# EasyEDA Pro project Chaoticvolt-SensorHUB-v1.0.eprj

# Schematic Choaticvolt_DP2_V1
Board Name: Choaticvolt_DP2_V1; Create Date: 2024-12-06; Page Name: Choaticvolt_DP2_V1; Project Name: Chaoticvolt-SensorHUB-v1.0; Schematic Name: Choaticvolt_DP2_V1; Update Date: 2024-12-07; Company: Chaoticvolt; Drawn: Robin; Page Size: A4; Part Number: CV-SHV1; Reviewed: Robin; Version: V1.0
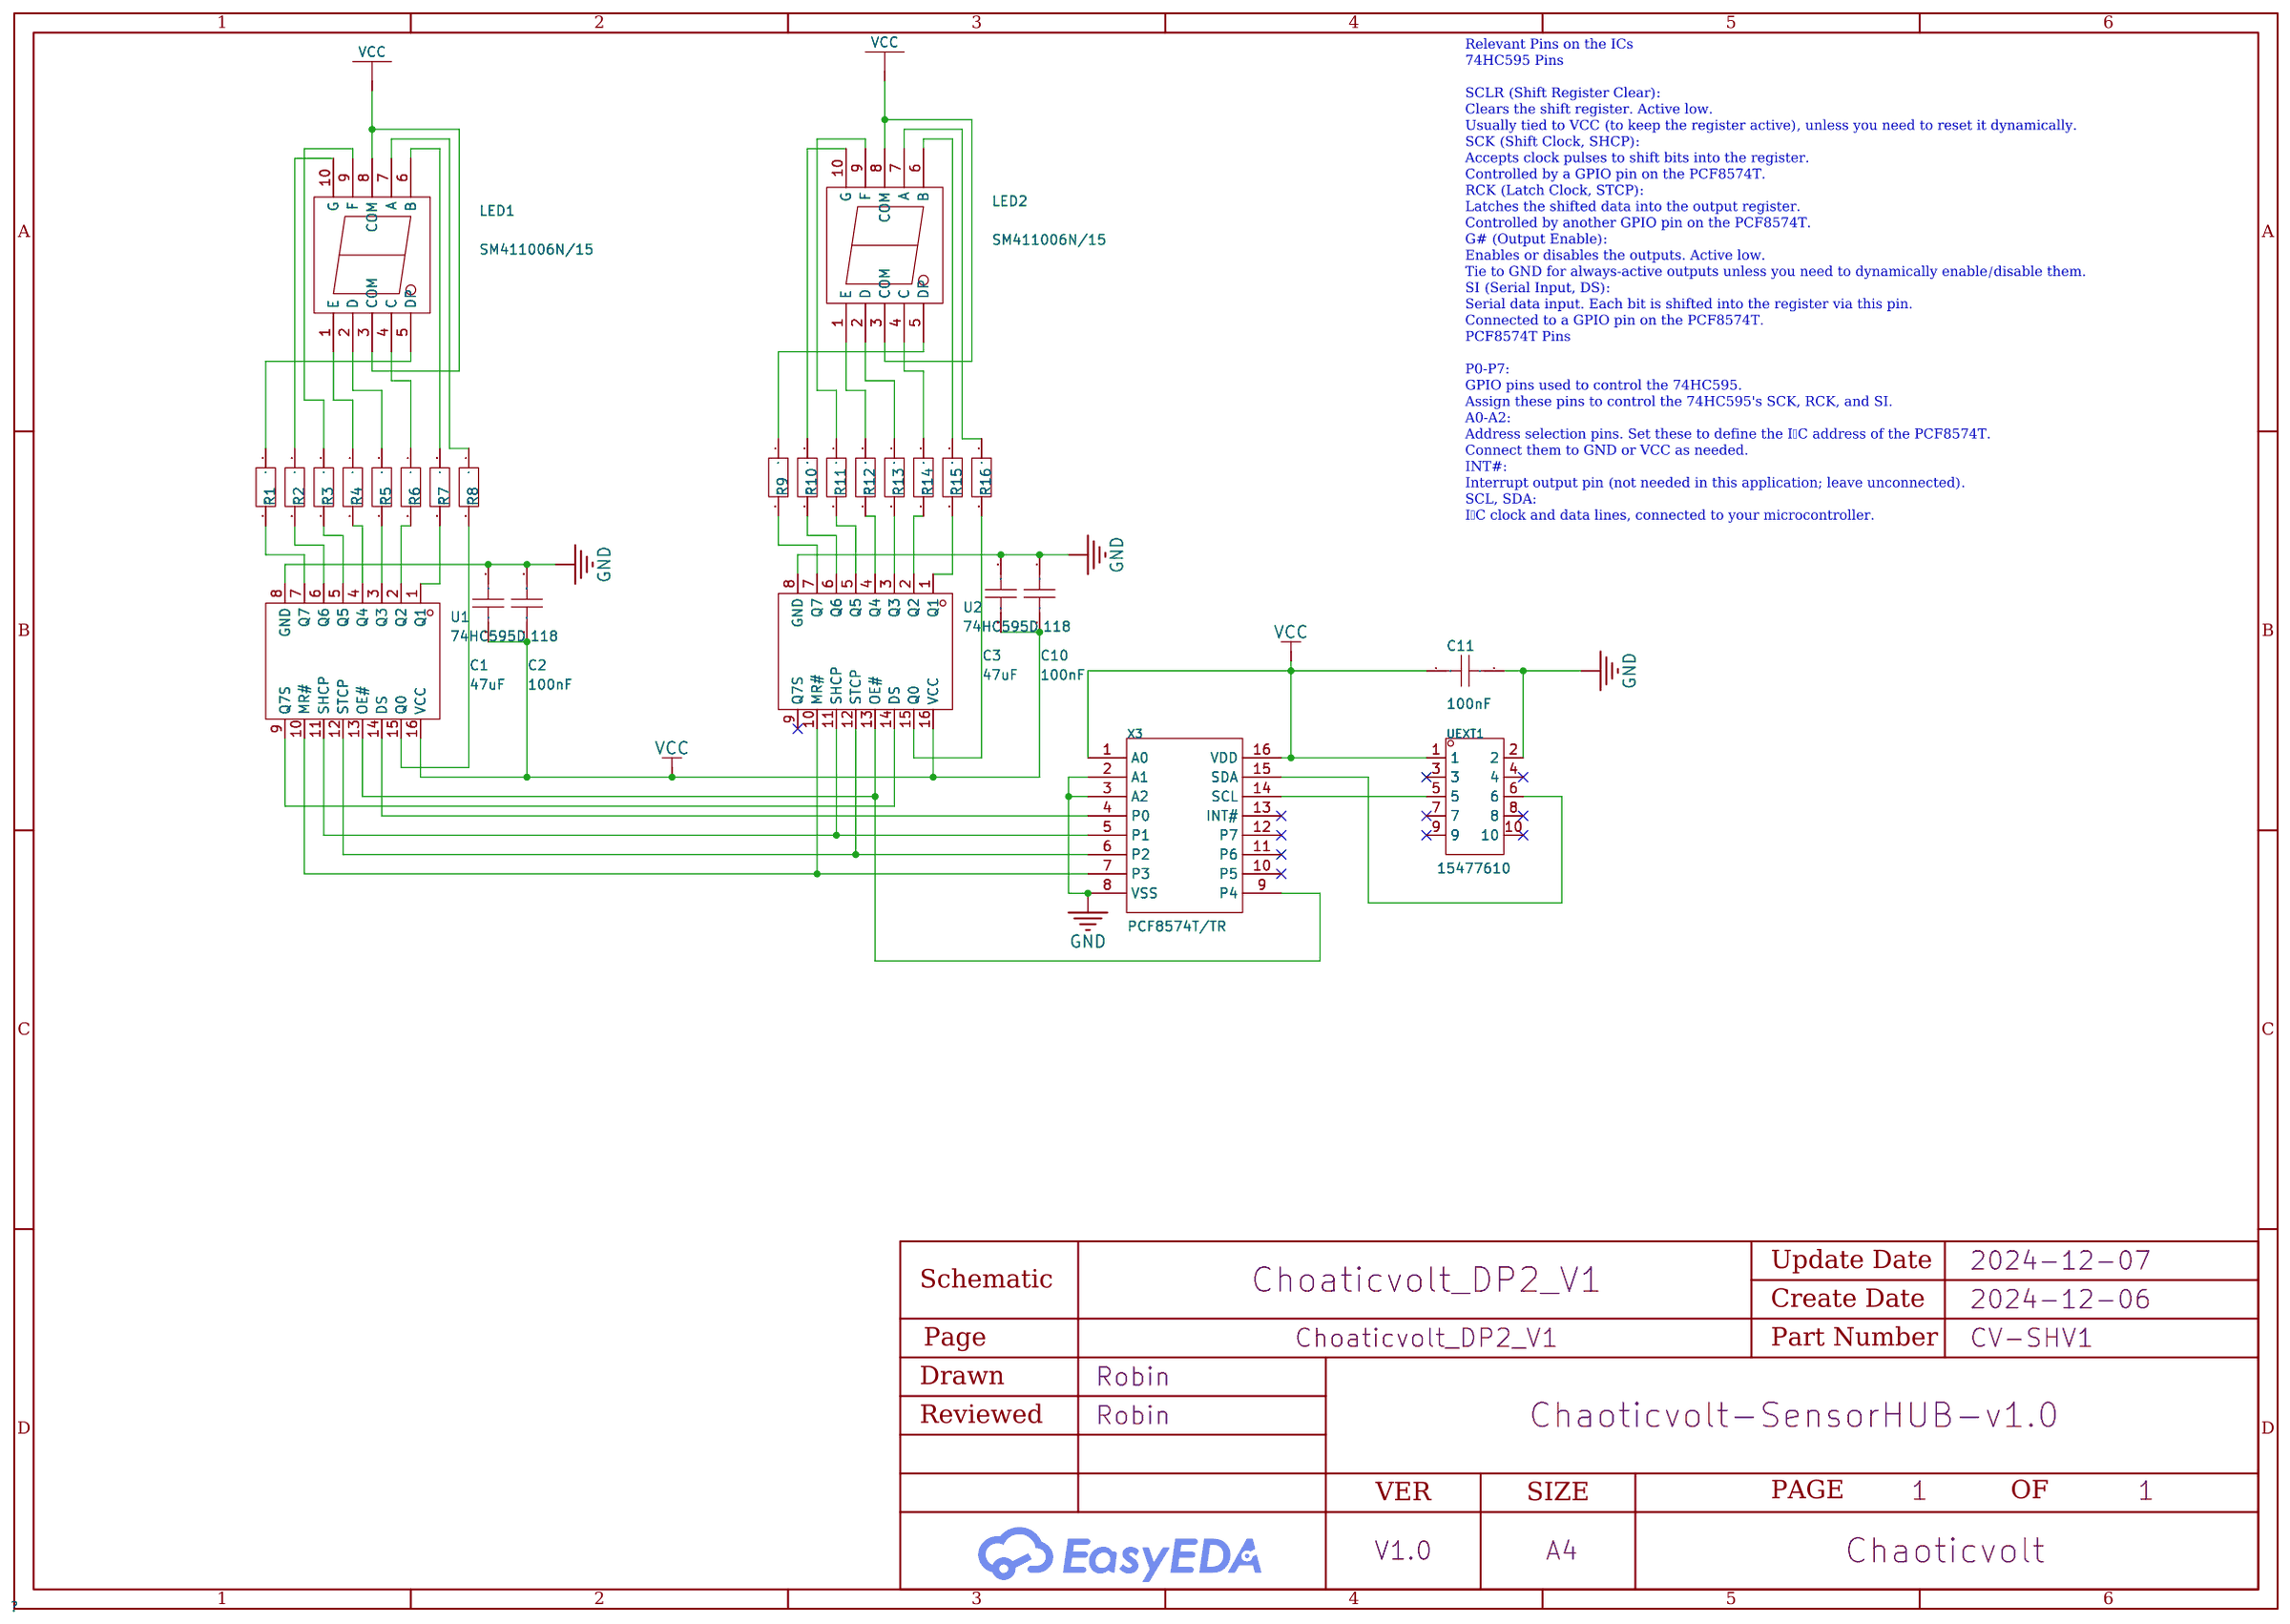
[diagram p0: schematic sheet]

## Parts
C1  47uF  [C1206]
C2  100nF  [C0402]
C3  47uF  [C1206]
C10  100nF  [C0402]
C11  100nF  [C0402]
LED1  SM411006N/15  [LED-SEG-TH_10P-L24.0-W34.0-P2.54-S30.48-BL]
LED2  SM411006N/15  [LED-SEG-TH_10P-L24.0-W34.0-P2.54-S30.48-BL]
R1  120Ω  [R0805]
R2  120Ω  [R0805]
R3  120Ω  [R0805]
R4  120Ω  [R0805]
R5  120Ω  [R0805]
R6  120Ω  [R0805]
R7  120Ω  [R0805]
R8  120Ω  [R0805]
R9  120Ω  [R0805]
R10  120Ω  [R0805]
R11  120Ω  [R0805]
R12  120Ω  [R0805]
R13  120Ω  [R0805]
R14  120Ω  [R0805]
R15  120Ω  [R0805]
R16  120Ω  [R0805]
U1  74HC595D,118  [SOIC-16_L9.9-W3.9-P1.27-LS6.0-BL]
U2  74HC595D,118  [SOIC-16_L9.9-W3.9-P1.27-LS6.0-BL]
UEXT1  15477610  [IDC-TH_15477610]
X3  PCF8574T/TR  [SO-16_L10.3-W7.5-P1.27-LS10.3-BL]

## Library data of the parts
C1 C3 = CL31A476MPHNNNE: Capacitance: Tolerance:±20% Tolerance:±20% Voltage Rated: Temperature Coefficient:; LCSC Part Name: 47uF ±20% 10V; Supplier Part: C96123; Manufacturer: SAMSUNG(三星); Supplier Footprint: 1206; JLCPCB Part Class: Basic Part; Datasheet: https://atta.szlcsc.com/upload/public/pdf/source/20160218/1457707763339.pdf; Supplier: LCSC; Tolerance: ±20%; Check: false
C2 C10 C11 = CL05B104KO5NNNC: Capacitance: Tolerance:±10% Tolerance:±10% Voltage Rated: Temperature Coefficient:; LCSC Part Name: 100nF ±10% 16V; Supplier Part: C1525; Manufacturer: SAMSUNG(三星); Supplier Footprint: 0402; JLCPCB Part Class: Basic Part; Datasheet: https://atta.szlcsc.com/upload/public/pdf/source/20160218/1457707763339.pdf; Supplier: LCSC; Tolerance: ±10%; Check: false
LED1 LED2 = SM411006N/15: Number of Characters:1Bit Luminous Color:Red LED Polarity:共阳极 Digit/Alpha Size(inch):1; LCSC Part Name: 1位1英寸红色数码管 共阳极; Supplier Part: C252204; Manufacturer: ARKLED(方舟); Supplier Footprint: 插件; JLCPCB Part Class: Extended Part; Datasheet: https://atta.szlcsc.com/upload/public/pdf/source/20180820/C252204_5419406E55C53E9FA3C2CBA754F32D78.pdf; Supplier: LCSC; Number of Characters: 1Bit; Luminous Color: Red; LED Polarity: 共阳极; Digit/Alpha Size(inch): 1; Check: false
R1-R16 = 0805W8F1200T5E: Type:Thick Film Resistors Resistance: Tolerance:±1% Tolerance:±1% Power(Watts): Overload Voltage (Max): Temperature Coefficient:±100ppm/℃ Temperature Coefficient:±100ppm/℃ Operating Temperature Range:-55℃~+155℃ Operating Temperature Range:-55℃~+155℃; LCSC Part Name: 120Ω ±1% 125mW 厚膜电阻; Supplier Part: C17437; Manufacturer: UNI-ROYAL(厚声); Supplier Footprint: 0805; JLCPCB Part Class: Basic Part; Datasheet: https://atta.szlcsc.com/upload/public/pdf/source/20200306/C422600_1E6D84923E4A46A82E41ADD87F860B5C.pdf; Supplier: LCSC; Type: Thick Film Resistors; Tolerance: ±1%; Temperature Coefficient: ±100ppm/℃; Operating Temperature Range: -55℃~+155℃; Check: false
U1 U2 = 74HC595D,118: Function:Serial to serial or parallel Supply Voltage:2V~6V Supply Voltage:2V~6V Number of Elements:1 Number of Bits per Element:8 Output Type:Tri-State Series: Operating Temperature:-40℃~+125℃ Operating Temperature:-40℃~+125℃; LCSC Part Name: 三态输出 串行至串行或并行移位寄存器; Supplier Part: C5947; Manufacturer: Nexperia(安世); Supplier Footprint: SOIC-16; JLCPCB Part Class: Basic Part; Datasheet: https://atta.szlcsc.com/upload/public/pdf/source/20240724/C3A3241CA190230F407C83CEC4244600.pdf; Supplier: LCSC; Function: Serial to serial or parallel; Supply Voltage: 2V~6V; Number of Elements: 1; Number of Bits per Element: 8; Output Type: Tri-State; Operating Temperature: -40℃~+125℃; Check: false
UEXT1 = 15477610: Pins Structure:2x5P Pitch:2.54mm Mounting Style:- Reference Series:- Number of Pins:10P Number of Rows:2 Number of PINs Per Row:5 Row Spacing:2.54mm Contact Material:Copper Alloy; Supplier Part: C293309; Manufacturer: MOLEX; Supplier Footprint: P=2.54mm; JLCPCB Part Class: Extended Part; Datasheet: https://atta.szlcsc.com/upload/public/pdf/source/20181128/C277394_FD4B97A8670359EF117E1C93E2183E6B.pdf; Supplier: LCSC; Pins Structure: 2x5P; Pitch: 2.54mm; Number of Pins: 10P; Number of Rows: 2; Number of PINs Per Row: 5; Row Spacing: 2.54mm; Contact Material: Copper Alloy; Check: false
X3 = PCF8574T/TR: Interface:I2C Number of I/O:8; LCSC Part Name: I2C总线 远程8位I/O扩展; Supplier Part: C2987288; Manufacturer: HGSEMI(华冠); Supplier Footprint: SO-16-300mil; JLCPCB Part Class: Extended Part; Datasheet: https://atta.szlcsc.com/upload/public/pdf/source/20190611/C398075_1925312D8618E19C6137781D5B71A3CA.pdf; Supplier: LCSC; Interface: I2C; Number of I/O: 8; Check: false

## Nets
GND: C1.2 C2.2 C3.2 C10.2 C11.1 U1.8(GND) U2.8(GND) UEXT1.2 X3.2(A1) X3.3(A2) X3.8(VSS)
VCC: C1.1 C2.1 C3.1 C10.1 C11.2 LED1.3(COM) LED1.8(COM) LED2.3(COM) LED2.8(COM) U1.16(VCC) U2.16(VCC) UEXT1.1 X3.1(A0) X3.16(VDD)
$1N2392: R1.2 U1.7(Q7)
$1N2394: R4.2 U1.4(Q4)
$1N2395: R6.2 U1.2(Q2)
$1N2396: R7.2 U1.1(Q1)
$1N2397: R2.2 U1.6(Q6)
$1N2398: R5.2 U1.3(Q3)
$1N2399: R3.2 U1.5(Q5)
$1N2400: R8.2 U1.15(Q0)
$1N2411: R9.2 U2.7(Q7)
$1N2412: R12.2 U2.4(Q4)
$1N2413: R14.2 U2.2(Q2)
$1N2414: R15.2 U2.1(Q1)
$1N2415: R10.2 U2.6(Q6)
$1N2416: R13.2 U2.3(Q3)
$1N2417: R11.2 U2.5(Q5)
$1N2418: R16.2 U2.15(Q0)
$1N2428: U1.9(Q7S) U2.14(DS)
$1N2430: U1.11(SHCP) U2.11(SHCP) X3.5(P1)
$1N2434: U1.12(STCP) U2.12(STCP) X3.6(P2)
$1N2437: U1.13(OE#) U2.13(OE#) X3.9(P4)
$1N3740: U1.14(DS) X3.4(P0)
$1N3774: U1.10(MR#) U2.10(MR#) X3.7(P3)
$1N3917: UEXT1.5 X3.14(SCL)
$1N3924: UEXT1.6 X3.15(SDA)
$1N26641: LED1.6(B) R7.1
$1N26647: LED1.7(A) R8.1
$1N26729: LED1.2(D) R5.1
$1N26736: LED1.1(E) R4.1
$1N26743: LED1.9(F) R3.1
$1N26751: LED1.10(G) R2.1
$1N26868: LED2.6(B) R15.1
$1N26872: LED2.7(A) R16.1
$1N26877: LED2.2(D) R13.1
$1N26881: LED2.1(E) R12.1
$1N26885: LED2.9(F) R11.1
$1N26891: LED2.10(G) R10.1
$1N27647: LED1.4(C) R6.1
$1N27662: LED1.5(DP) R1.1
$1N27688: LED2.4(C) R14.1
$1N27703: LED2.5(DP) R9.1

Not connected (* = marked no-connect by the designer): U2 9(Q7S)*; UEXT1 3* 4* 7* 8* 9* 10*; X3 10(P5)* 11(P6)* 12(P7)* 13(INT#)*

## Notes on the sheet
- Relevant Pins on the ICs
  74HC595 Pins
  SCLR (Shift Register Clear):
  Clears the shift register. Active low.
  Usually tied to VCC (to keep the register active), unless you need to reset it dynamically.
  SCK (Shift Clock, SHCP):
  Accepts clock pulses to shift bits into the register.
  Controlled by a GPIO pin on the PCF8574T.
  RCK (Latch Clock, STCP):
  Latches the shifted data into the output register.
  Controlled by another GPIO pin on the PCF8574T.
  G# (Output Enable):
  Enables or disables the outputs. Active low.
  Tie to GND for always-active outputs unless you need to dynamically enable/disable them.
  SI (Serial Input, DS):
  Serial data input. Each bit is shifted into the register via this pin.
  Connected to a GPIO pin on the PCF8574T.
  PCF8574T Pins
  P0-P7:
  GPIO pins used to control the 74HC595.
  Assign these pins to control the 74HC595's SCK, RCK, and SI.
  A0-A2:
  Address selection pins. Set these to define the I²C address of the PCF8574T.
  Connect them to GND or VCC as needed.
  INT#:
  Interrupt output pin (not needed in this application; leave unconnected).
  SCL, SDA:
  I²C clock and data lines, connected to your microcontroller.

# Schematic Choaticvolt_UCB1_V1
Board Name: Choaticvolt_UCB1_V1; Create Date: 2024-12-07; Page Name: Choaticvolt_UCB1_V1; Project Name: Chaoticvolt-SensorHUB-v1.0; Schematic Name: Choaticvolt_UCB1_V1; Update Date: 2024-12-07; Company: EasyEDA.com; Drawn: EasyEDA; Page Size: A4; Part Number: JLCPCB-002; Reviewed: EasyEDA; Version: V0.1
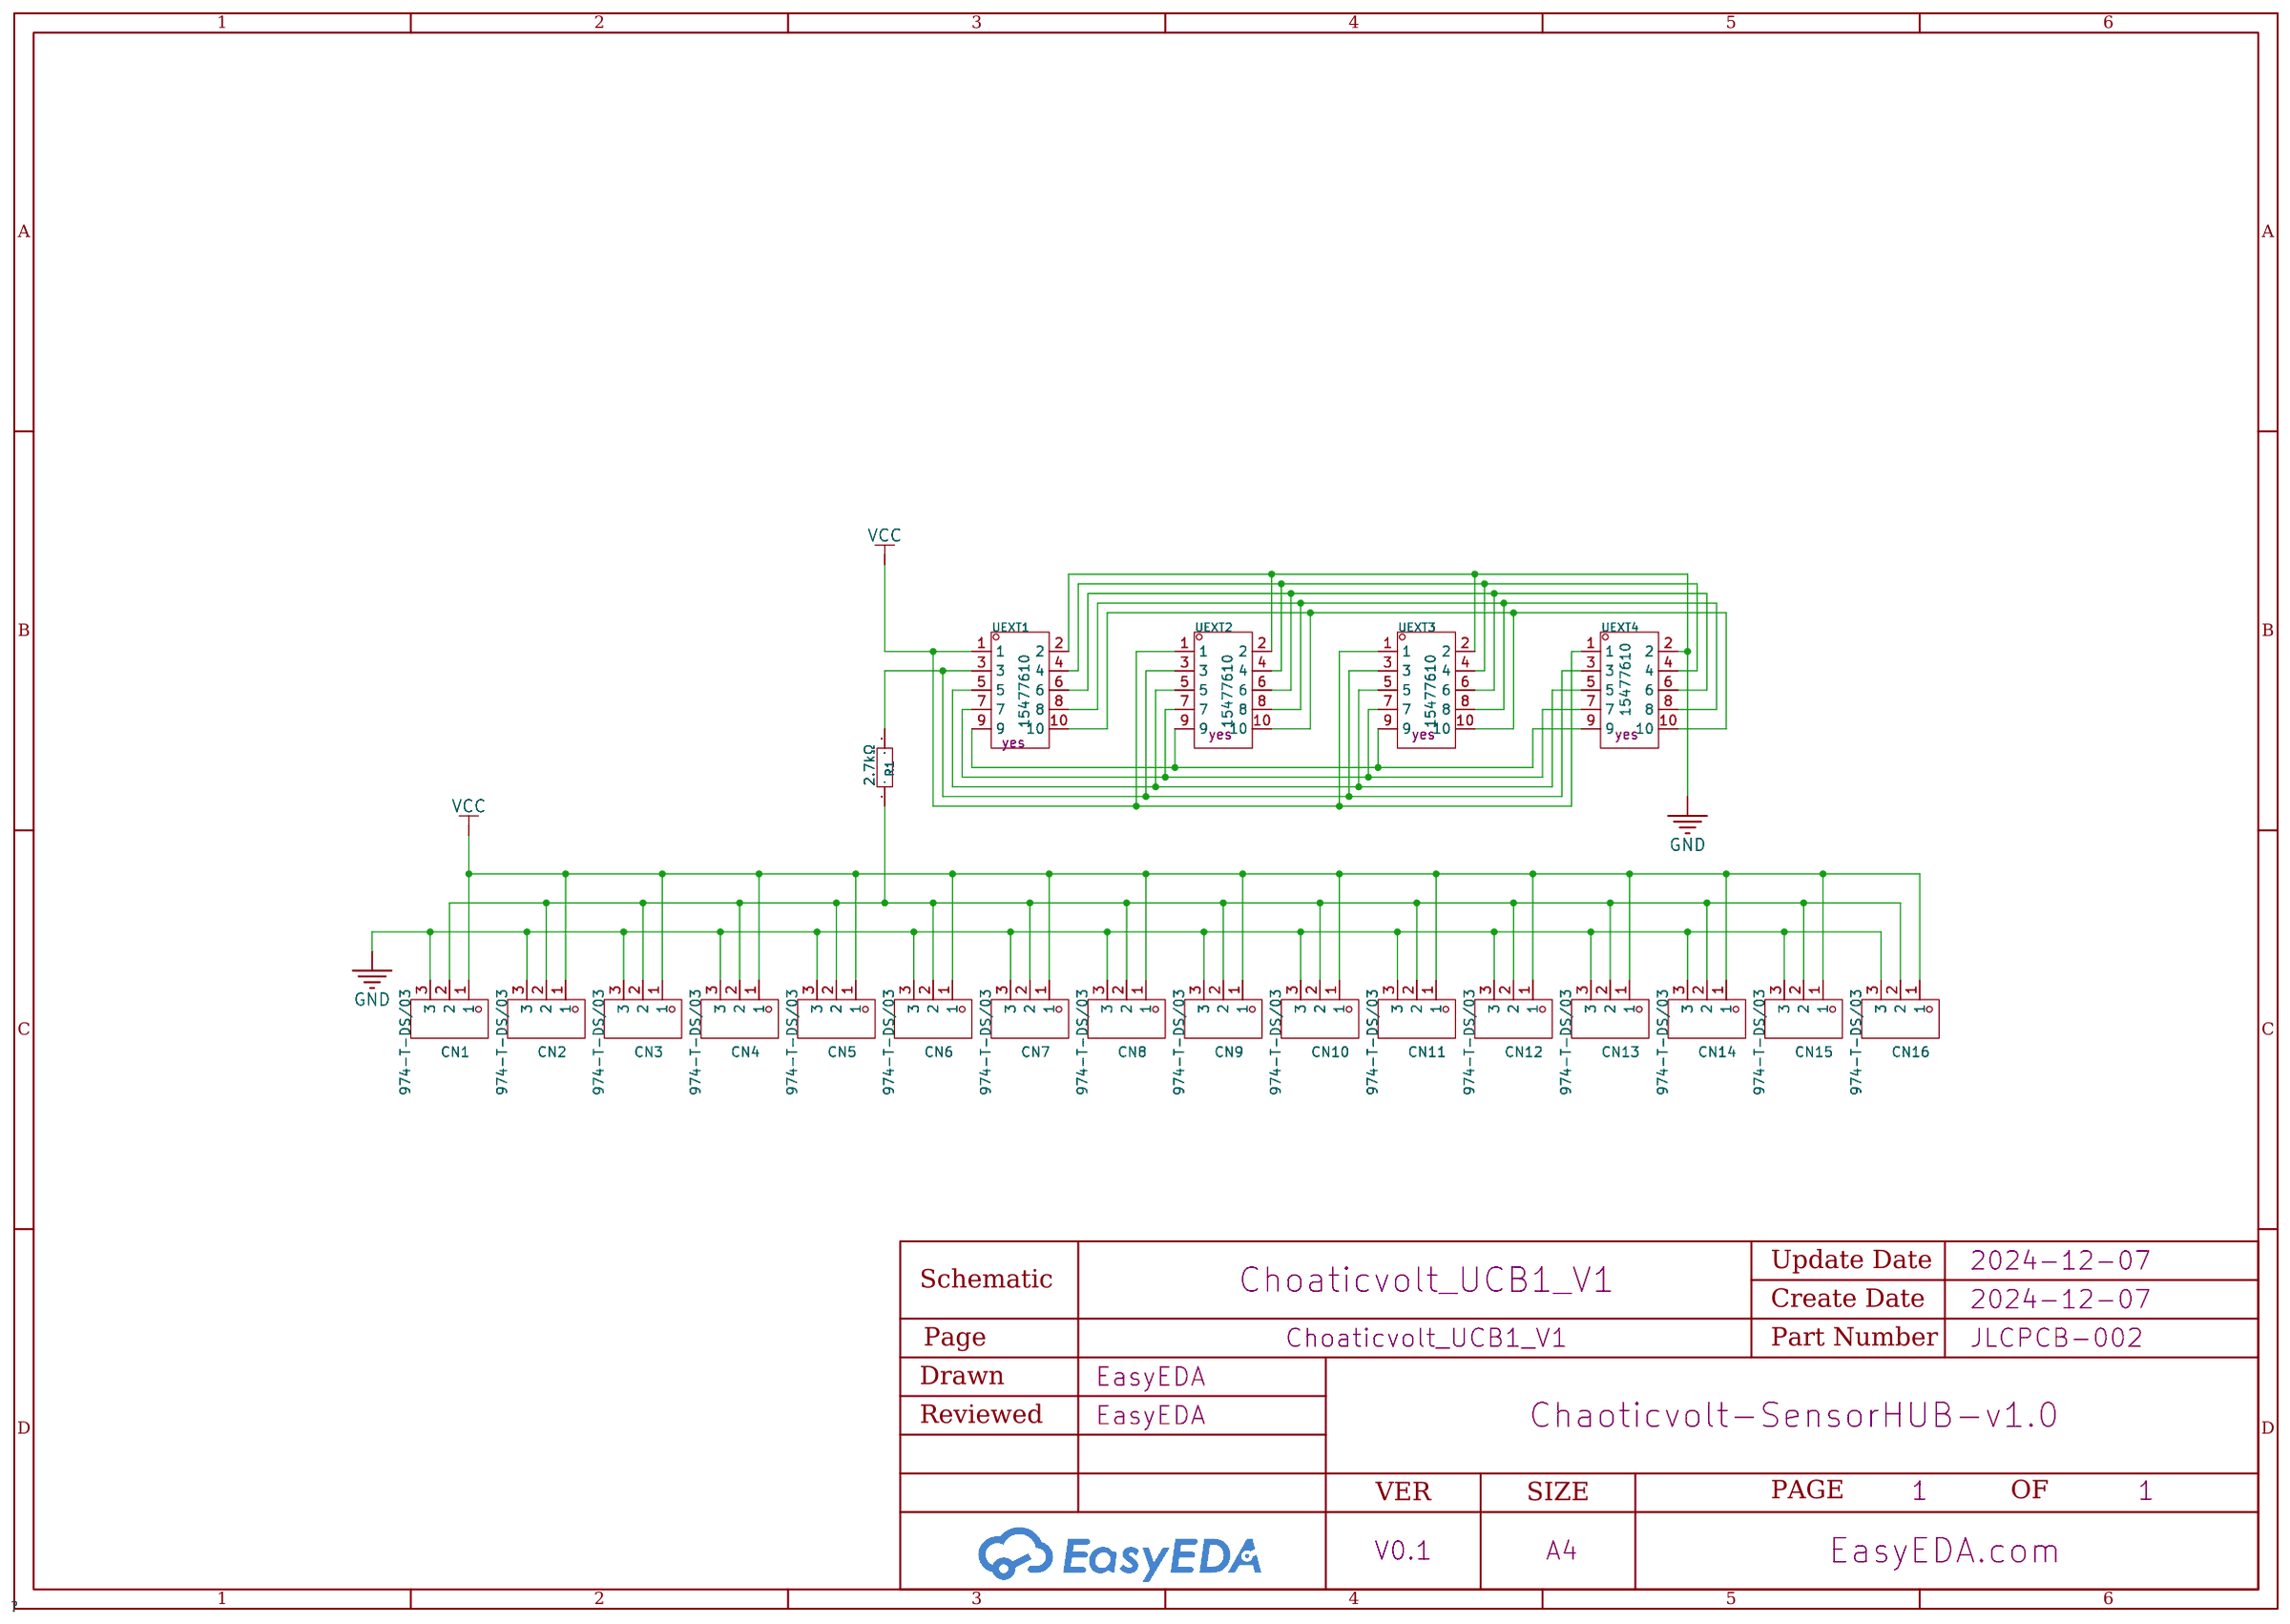
[diagram p1: schematic sheet]

## Parts
CN1  974-T-DS/03  [CONN-TH_3P-P5.00_WECO_974-T-DS-03]
CN2  974-T-DS/03  [CONN-TH_3P-P5.00_WECO_974-T-DS-03]
CN3  974-T-DS/03  [CONN-TH_3P-P5.00_WECO_974-T-DS-03]
CN4  974-T-DS/03  [CONN-TH_3P-P5.00_WECO_974-T-DS-03]
CN5  974-T-DS/03  [CONN-TH_3P-P5.00_WECO_974-T-DS-03]
CN6  974-T-DS/03  [CONN-TH_3P-P5.00_WECO_974-T-DS-03]
CN7  974-T-DS/03  [CONN-TH_3P-P5.00_WECO_974-T-DS-03]
CN8  974-T-DS/03  [CONN-TH_3P-P5.00_WECO_974-T-DS-03]
CN9  974-T-DS/03  [CONN-TH_3P-P5.00_WECO_974-T-DS-03]
CN10  974-T-DS/03  [CONN-TH_3P-P5.00_WECO_974-T-DS-03]
CN11  974-T-DS/03  [CONN-TH_3P-P5.00_WECO_974-T-DS-03]
CN12  974-T-DS/03  [CONN-TH_3P-P5.00_WECO_974-T-DS-03]
CN13  974-T-DS/03  [CONN-TH_3P-P5.00_WECO_974-T-DS-03]
CN14  974-T-DS/03  [CONN-TH_3P-P5.00_WECO_974-T-DS-03]
CN15  974-T-DS/03  [CONN-TH_3P-P5.00_WECO_974-T-DS-03]
CN16  974-T-DS/03  [CONN-TH_3P-P5.00_WECO_974-T-DS-03]
R1  2.7kΩ  [RES-TH_BD3.3-L9.0-P13.00-D0.6]
UEXT1  15477610  [IDC-TH_15477610]
UEXT2  15477610  [IDC-TH_15477610]
UEXT3  15477610  [IDC-TH_15477610]
UEXT4  15477610  [IDC-TH_15477610]

## Library data of the parts
CN1-CN16 = 974-T-DS/03: Structure:1x3P Pitch:5mm Color:Gray Mounting Style:Bend insert Number of Pins:3P Number of Rows:1 Number of PINs Per Row:3 Screw Specification:M3 Current Rating (Max):24A Voltage Rating (Max):250V Wire Gauge - AWG:12~18；12~16 Wire Gauge - AWG:12~18；12~16; LCSC Part Name: 1x3P 5mm 弯插 排数:1 每排P数:3; Supplier Part: C2974863; Manufacturer: WECO(威克德诺); Supplier Footprint: 插件,P=5mm; JLCPCB Part Class: Extended Part; Datasheet: https://atta.szlcsc.com/upload/public/pdf/source/20220222/EDF1964097EA97B7DAC2F4F276B20705.pdf; Supplier: LCSC; Structure: 1x3P; Pitch: 5mm; Color: Gray; Mounting Style: Bend insert; Number of Pins: 3P; Number of Rows: 1; Number of PINs Per Row: 3; Screw Specification: M3; Current Rating (Max): 24A; Voltage Rating (Max): 250V; Wire Gauge - AWG: 12~18；12~16; Wire Gauge - mm2: 0.75~4；1~6; Operating Temperature Range: -40℃~+100℃
R1 = MFR1WSJT-52-2K7: Type:Metal Film Resistors Resistance: Tolerance:±5% Tolerance:±5% Power(Watts):1W Operating Temperature Range:-55℃~+155℃ Operating Temperature Range:-55℃~+155℃; LCSC Part Name: 金属膜电阻 2.7kΩ ±5% 1W; Supplier Part: C176423; Manufacturer: YAGEO(国巨); Supplier Footprint: 插件,D3.3xL9mm; JLCPCB Part Class: Extended Part; Datasheet: https://atta.szlcsc.com/upload/public/pdf/source/20191118/C457825_18355E864DE4965678DC27B0EBC3E21E.pdf; Supplier: LCSC; Type: Metal Film Resistors; Tolerance: ±5%; Power(Watts): 1W; Operating Temperature Range: -55℃~+155℃
UEXT1-UEXT4 = 15477610: Pins Structure:2x5P Pitch:2.54mm Mounting Style:- Reference Series:- Number of Pins:10P Number of Rows:2 Number of PINs Per Row:5 Row Spacing:2.54mm Contact Material:Copper Alloy; Supplier Part: C293309; Manufacturer: MOLEX; Supplier Footprint: P=2.54mm; JLCPCB Part Class: Extended Part; Datasheet: https://atta.szlcsc.com/upload/public/pdf/source/20181128/C277394_FD4B97A8670359EF117E1C93E2183E6B.pdf; Supplier: LCSC; Pins Structure: 2x5P; Pitch: 2.54mm; Number of Pins: 10P; Number of Rows: 2; Number of PINs Per Row: 5; Row Spacing: 2.54mm; Contact Material: Copper Alloy

## Nets
GND: CN1.3 CN2.3 CN3.3 CN4.3 CN5.3 CN6.3 CN7.3 CN8.3 CN9.3 CN10.3 CN11.3 CN12.3 CN13.3 CN14.3 CN15.3 CN16.3 UEXT1.2 UEXT2.2 UEXT3.2 UEXT4.2
VCC: CN1.1 CN2.1 CN3.1 CN4.1 CN5.1 CN6.1 CN7.1 CN8.1 CN9.1 CN10.1 CN11.1 CN12.1 CN13.1 CN14.1 CN15.1 CN16.1 UEXT1.1 UEXT2.1 UEXT3.1 UEXT4.1
$1N825: CN1.2 CN2.2 CN3.2 CN4.2 CN5.2 CN6.2 CN7.2 CN8.2 CN9.2 CN10.2 CN11.2 CN12.2 CN13.2 CN14.2 CN15.2 CN16.2 R1.1
$1N1392: UEXT1.9 UEXT2.9 UEXT3.9 UEXT4.9
$1N1399: UEXT1.7 UEXT2.7 UEXT3.7 UEXT4.7
$1N1421: UEXT1.5 UEXT2.5 UEXT3.5 UEXT4.5
$1N1566: R1.2 UEXT1.3 UEXT2.3 UEXT3.3 UEXT4.3
$1N1663: UEXT1.10 UEXT2.10 UEXT3.10 UEXT4.10
$1N1691: UEXT1.6 UEXT2.6 UEXT3.6 UEXT4.6
$1N1700: UEXT1.4 UEXT2.4 UEXT3.4 UEXT4.4
$1N1774: UEXT1.8 UEXT2.8 UEXT3.8 UEXT4.8

# Board PCB_Choaticvolt_UCB1_V1
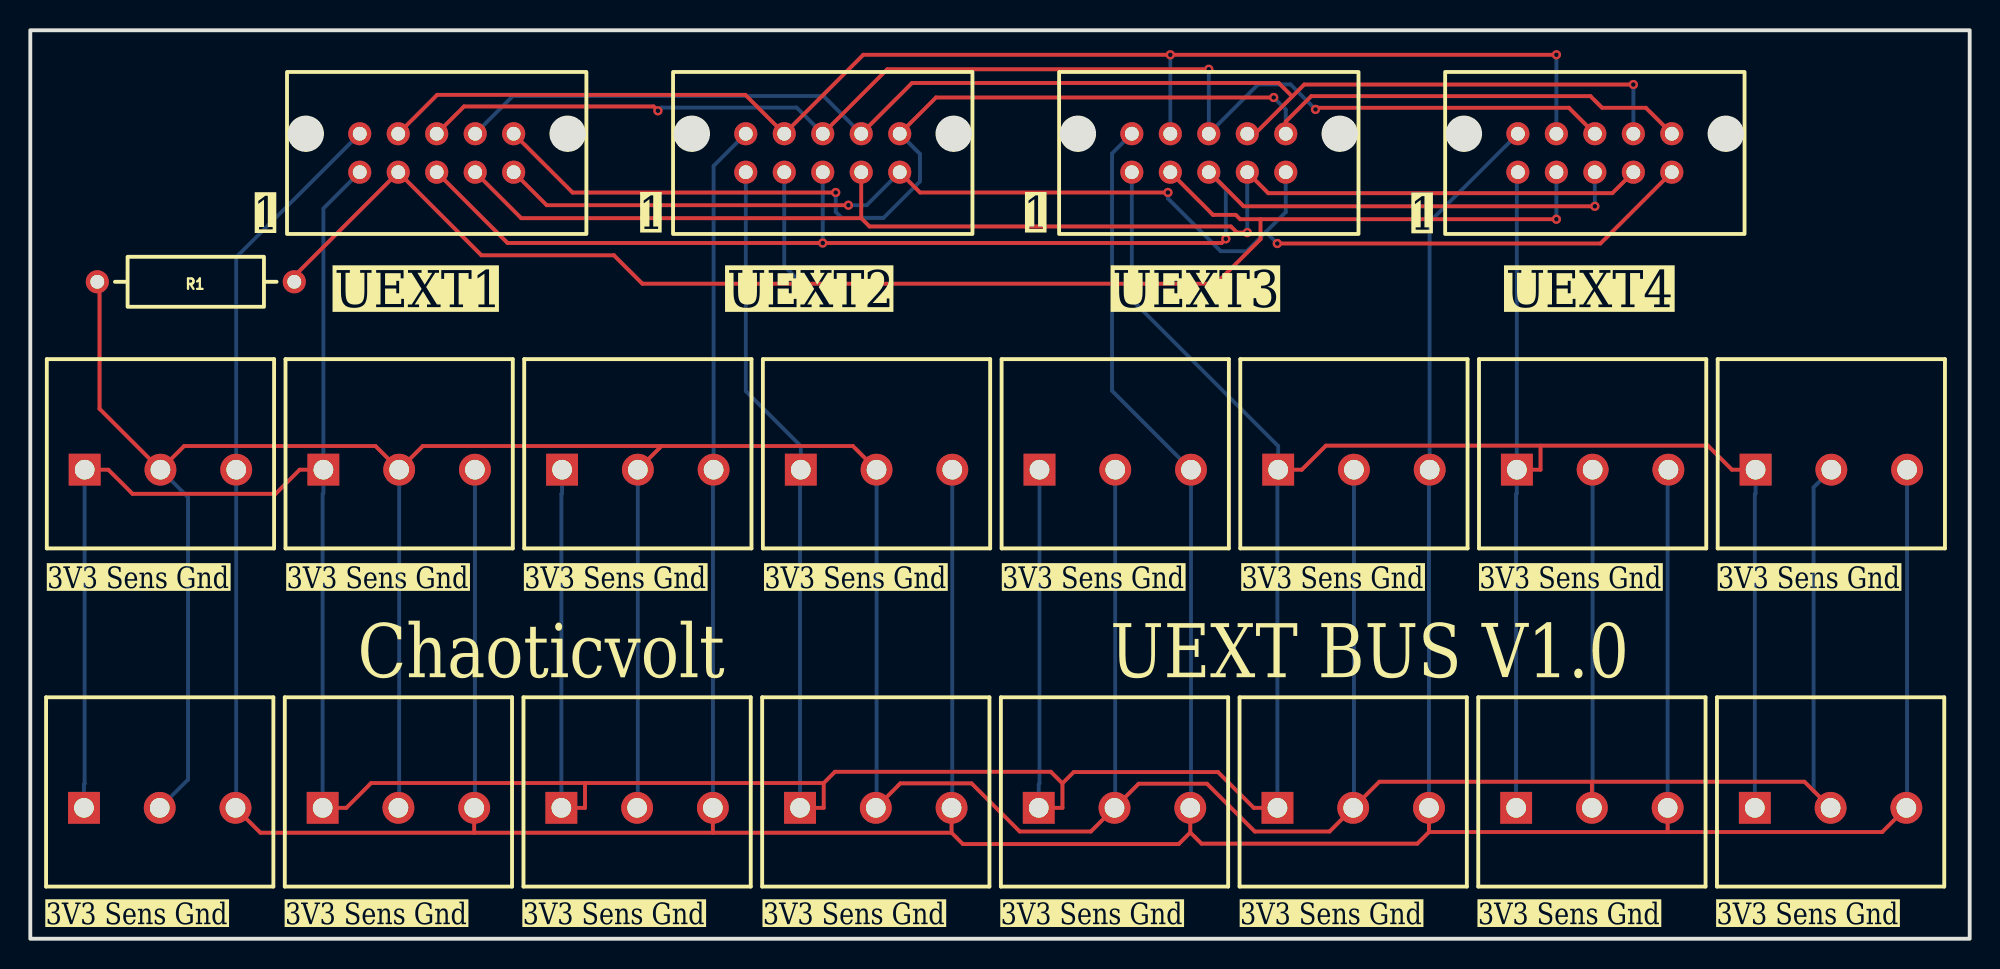
[diagram p2: board, top side]
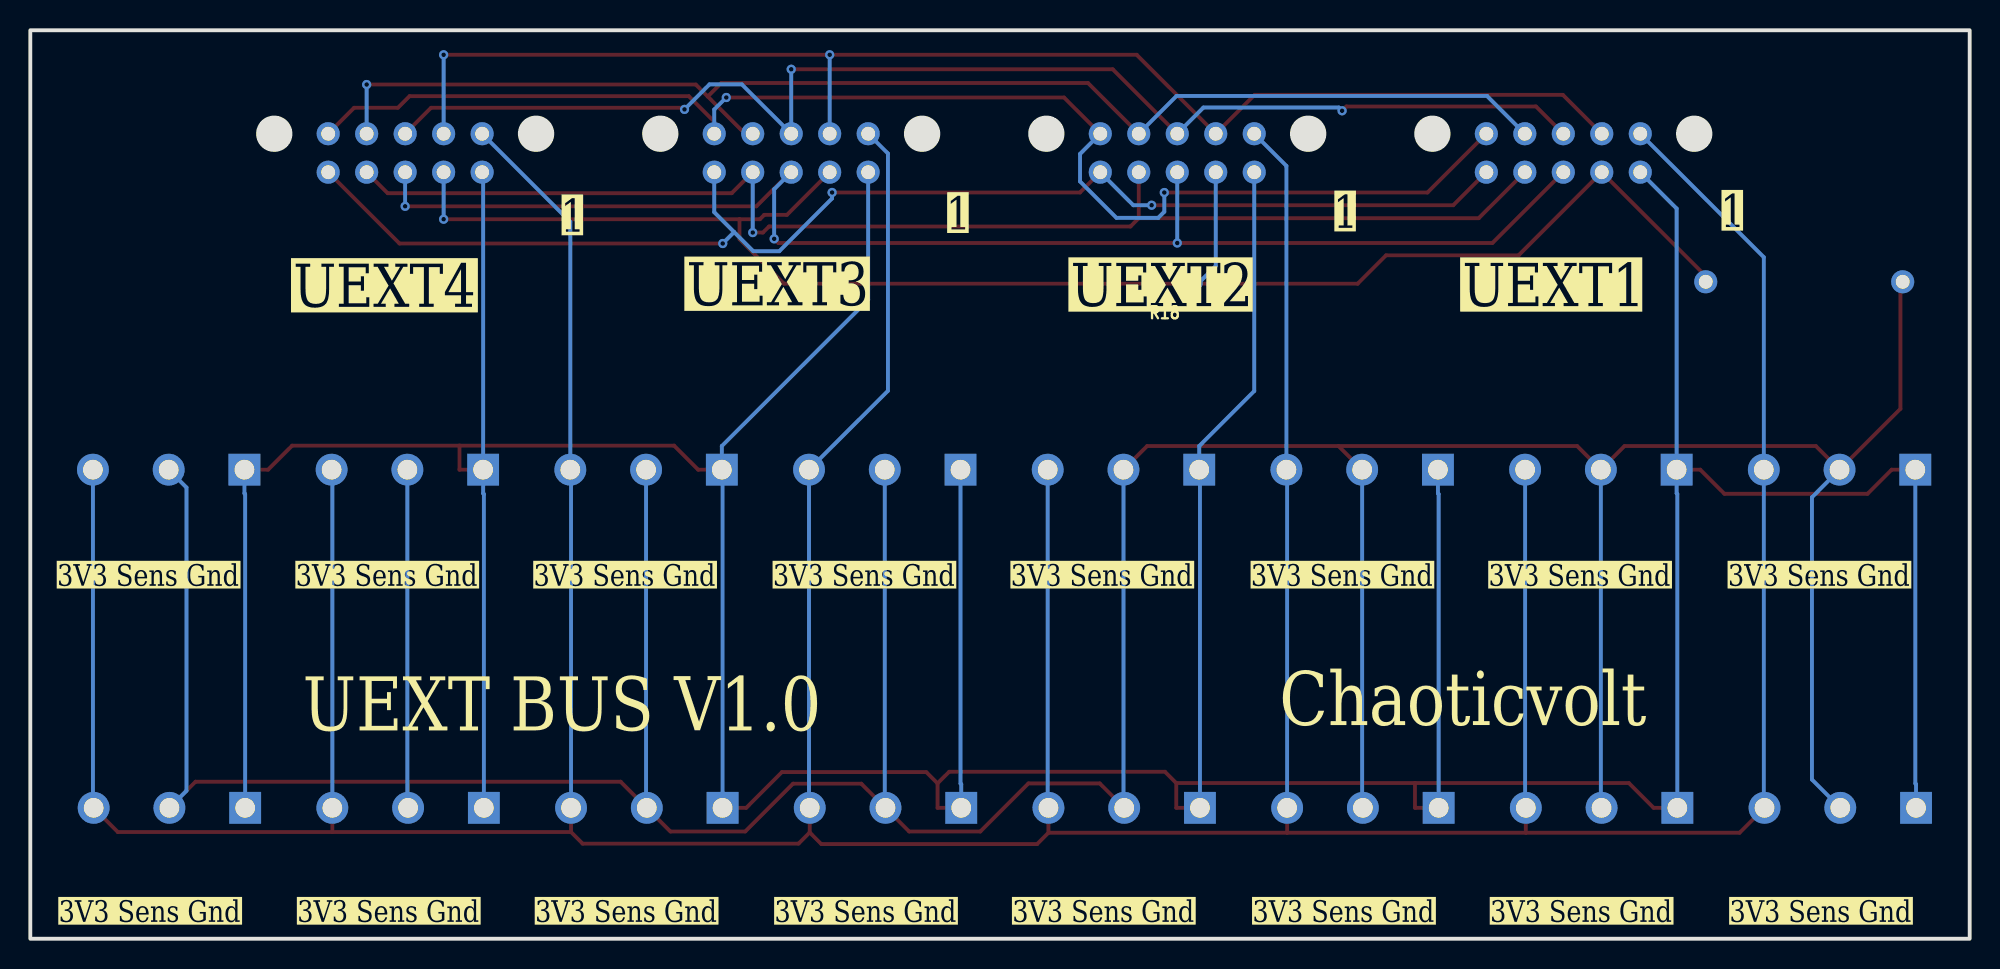
[diagram p3: board, bottom side, seen from below]

Outline 128 x 60 mm; copper layers: Top Layer, Bottom Layer. Coordinates in mm from the lower left corner of the outline.
Outline path: rectangle 0,60 128,0
Stack: Top Layer 0.035mm / Dielectric1 1.51mm FR4 er 4.5 / Bottom Layer 0.035mm

## Design rules (mm)
template: JLCPCB Capability(Two Layers Board)
spacing copperThickness1oz (default): track to track 0.102, other pairs 0.152 to 0.3
spacing copperThickness2oz: track to track 0.203, other pairs 0.152 to 0.3
track width copperThickness1oz (default): min 0.127, default 0.254, max 2.54
track width copperThickness2oz: min 0.203, default 0.254, max 2.54
differential pair differentialPair (default): width min 0.127, default 0.254, max 2.54; gap min 0.152, default 0.152
via viaSize (default): diameter min 0.5, default 0.61, max 10; hole min 0.3, default 0.305, max 6.3

## Placement (name value [footprint] x y rotation side)
CN1  974-T-DS/03  [CONN-TH_3P-P5.00_WECO_974-T-DS-03]  8.54 8.64 0 top
CN2  974-T-DS/03  [CONN-TH_3P-P5.00_WECO_974-T-DS-03]  24.3 8.64 0 top
CN3  974-T-DS/03  [CONN-TH_3P-P5.00_WECO_974-T-DS-03]  40.05 8.64 0 top
CN4  974-T-DS/03  [CONN-TH_3P-P5.00_WECO_974-T-DS-03]  55.8 8.64 0 top
CN5  974-T-DS/03  [CONN-TH_3P-P5.00_WECO_974-T-DS-03]  71.56 8.64 0 top
CN6  974-T-DS/03  [CONN-TH_3P-P5.00_WECO_974-T-DS-03]  87.31 8.64 0 top
CN7  974-T-DS/03  [CONN-TH_3P-P5.00_WECO_974-T-DS-03]  103.07 8.64 0 top
CN8  974-T-DS/03  [CONN-TH_3P-P5.00_WECO_974-T-DS-03]  118.82 8.64 0 top
CN9  974-T-DS/03  [CONN-TH_3P-P5.00_WECO_974-T-DS-03]  8.59 30.98 0 top
CN10  974-T-DS/03  [CONN-TH_3P-P5.00_WECO_974-T-DS-03]  24.34 30.98 0 top
CN11  974-T-DS/03  [CONN-TH_3P-P5.00_WECO_974-T-DS-03]  40.1 30.98 0 top
CN12  974-T-DS/03  [CONN-TH_3P-P5.00_WECO_974-T-DS-03]  55.85 30.98 0 top
CN13  974-T-DS/03  [CONN-TH_3P-P5.00_WECO_974-T-DS-03]  71.61 30.98 0 top
CN14  974-T-DS/03  [CONN-TH_3P-P5.00_WECO_974-T-DS-03]  87.36 30.98 0 top
CN15  974-T-DS/03  [CONN-TH_3P-P5.00_WECO_974-T-DS-03]  103.11 30.98 0 top
CN16  974-T-DS/03  [CONN-TH_3P-P5.00_WECO_974-T-DS-03]  118.87 30.98 0 top
R1  2.7kΩ  [RES-TH_BD3.3-L9.0-P13.00-D0.6]  10.92 43.39 0 top
UEXT1  15477610  [IDC-TH_15477610]  26.82 51.9 0 top
UEXT2  15477610  [IDC-TH_15477610]  52.3 51.9 0 top
UEXT3  15477610  [IDC-TH_15477610]  77.78 51.9 0 top
UEXT4  15477610  [IDC-TH_15477610]  103.26 51.9 0 top

## Footprints (pads in the part's own frame, mm; a bottom-side part is the same pattern mirrored in y, then rotated)
CONN-TH_3P-P5.00_WECO_974-T-DS-03
  rect 2.1x2.1 hole 1.3: 1(-5,0)
  round 2.1 hole 1.3: 2(0,0) 3(5,0)
IDC-TH_15477610
  round 1.524 hole 0.914: 1(-5.08,-1.27) 2(-5.08,1.27) 3(-2.54,-1.27) 4(-2.54,1.27) 5(0,-1.27) 6(0,1.27) 7(2.54,-1.27) 8(2.54,1.27) 9(5.08,-1.27) 10(5.08,1.27)
RES-TH_BD3.3-L9.0-P13.00-D0.6
  round 1.524 hole 0.914: 1(-6.5,0) 2(6.5,0)

## Nets
As in the schematic.

## Via types
v1: diameter 0.61, hole 0.305, Top Layer to Bottom Layer, 17 vias

## Routing (per net, layer and track width the routed paths; a pad name or vN(x,y) marks a point on that pad's centre or on a via; arc(x,y) is an arc through that point)
GND: length 399.6
  Top Layer w0.254: 108.06,7.05 122.22,7.05 CN8.3 ; 108.06,7.05 108.06,8.64 ; 108.06,7.05 92.31,7.05 ; 60.8,8.64 60.8,7 ; 60.8,7 61.55,6.25 75.79,6.25 76.56,7.02 ; 60.8,7 45.05,7 ; 76.56,7.02 77.3,6.28 91.54,6.28 92.31,7.05 ; 76.56,7.02 CN5.3 ; 92.31,7.05 CN6.3 ; 29.3,7 15.19,7 13.54,8.64 ; 29.3,7 CN2.3 ; 29.3,7 45.05,7 ; 45.05,7 CN3.3
  Bottom Layer w0.254: CN8.3 123.87,8.69 123.87,30.98 ; CN3.3 45.05,30.93 45.1,30.98 45.1,51.04 47.22,53.17 ; UEXT1.2 13.59,45.01 13.59,8.69 13.54,8.64 ; UEXT3.2 71.4,51.86 71.4,36.19 76.61,30.98 76.61,8.69 CN5.3 ; 60.85,30.98 60.85,8.69 60.8,8.64 ; CN2.3 29.34,8.69 29.34,30.98 ; 108.06,8.64 108.06,30.93 108.11,30.98 ; CN6.3 92.31,30.93 92.36,30.98 92.36,47.35 UEXT4.2
VCC: length 393.8
  Top Layer w0.254: 68.12,10.26 68.86,11.01 78.39,11.01 80.75,8.64 CN6.1 ; 68.12,10.26 67.35,11.03 53.11,11.03 52.36,10.28 ; 68.12,10.26 68.12,8.64 CN5.1 ; 99.67,32.57 99.67,30.98 98.11,30.98 ; 99.67,32.57 110.72,32.57 112.31,30.98 113.87,30.98 ; 99.67,32.57 85.51,32.57 83.92,30.98 82.36,30.98 ; 52.36,10.28 36.61,10.28 ; 52.36,10.28 52.36,8.64 50.8,8.64 ; 36.61,10.28 36.61,8.64 CN3.1 ; 36.61,10.28 22.49,10.28 20.86,8.64 CN2.1 ; 19.34,30.98 17.78,30.98 16.19,29.39 6.74,29.39 5.15,30.98 3.59,30.98
  Bottom Layer w0.254: 50.85,30.98 50.85,31.76 ; 50.85,31.76 50.85,32.54 47.22,36.17 47.22,50.63 ; 50.85,31.76 50.8,31.71 50.8,8.64 ; UEXT4.1 98.11,50.56 98.11,29.42 98.06,29.37 98.06,8.64 ; CN2.1 19.3,29.37 19.34,29.42 19.34,48.23 UEXT1.1 ; 82.36,31.76 82.36,32.54 72.7,42.2 UEXT3.1 ; 82.36,31.76 82.36,30.98 ; 82.36,31.76 82.31,31.71 CN6.1 ; 113.87,30.98 113.87,29.42 113.82,29.37 CN8.1 ; 35.1,30.98 35.1,29.42 35.05,29.37 CN3.1 ; 66.61,30.98 66.61,10.25 66.56,10.21 CN5.1 ; 3.54,8.64 3.54,10.21 3.59,10.25 3.59,30.98
$1N825: length 318.9
  Top Layer w0.254: 41.66,32.54 54.29,32.54 55.85,30.98 ; 41.66,32.54 25.91,32.54 24.34,30.98 22.78,32.54 10.15,32.54 8.59,30.98 ; 41.66,32.54 40.1,30.98 ; R1.1 4.57,43.24 4.57,35 CN9.2 ; 103.07,10.37 117.09,10.37 118.82,8.64 ; 103.07,10.37 89.04,10.37 CN6.2 85.75,7.08 80.81,7.08 77.66,10.24 73.15,10.24 70,7.08 65.3,7.08 62.12,10.26 57.42,10.26 CN4.2 ; 103.07,10.37 CN7.2
  Bottom Layer w0.254: CN6.2 87.36,8.69 87.36,30.98 ; CN7.2 103.11,8.69 103.11,30.98 ; 40.1,30.98 40.1,8.69 40.05,8.64 ; CN1.2 10.41,10.51 10.41,29.16 8.59,30.98 ; 24.34,30.98 24.34,8.69 CN2.2 ; CN4.2 55.85,8.69 55.85,30.98 ; 71.56,8.64 71.6,8.69 71.6,30.98 ; 118.87,30.98 117.69,29.8 117.69,9.77 118.82,8.64
$1N1392: length 87.9
  Top Layer w0.254: v1(53.99,48.45) 34.08,48.45 UEXT1.9 ; v1(75.08,49.29) 58.72,49.29 57.38,50.63 ; v1(82.3,45.92) 103.63,45.92 UEXT4.9
  Bottom Layer w0.254: v1(53.99,48.45) 55.2,48.45 57.38,50.63 ; 81.55,46.67 82.86,47.99 82.86,50.63 ; 81.55,46.67 v1(82.3,45.92) ; 81.55,46.67 80.28,45.41 78.57,45.41 75.08,48.89 v1(75.08,49.29)
$1N1399: length 86.3
  Top Layer w0.254: 54.84,47.59 32.4,47.59 UEXT1.7 ; 54.84,47.59 54.84,50.63 ; 54.84,47.59 55.39,47.04 79.24,47.04 79.65,46.64 v1(80.32,46.64) ; UEXT4.7 104.41,49.24 81.71,49.24 UEXT3.7
  Bottom Layer w0.254: UEXT3.7 v1(80.32,46.64)
$1N1421: length 92.3
  Top Layer w0.254: UEXT1.5 31.5,45.95 v1(52.3,45.95) 78.63,45.95 v1(78.91,46.23) ; UEXT3.5 77.83,50.63 80.08,48.37 v1(103.26,48.37)
  Bottom Layer w0.254: v1(78.91,46.23) 78.91,49.5 UEXT3.5 ; UEXT4.5 v1(103.26,48.37) ; 52.3,50.63 v1(52.3,45.95)
$1N1566: length 110.3
  Top Layer w0.254: UEXT3.3 78.06,47.81 79.56,47.81 79.85,47.52 81.19,47.52 ; 81.19,47.52 v1(100.72,47.52) ; 81.19,47.52 81.19,46.2 78.25,43.26 v1(50.93,43.26) 40.4,43.26 38.52,45.14 29.77,45.14 UEXT1.3 17.42,43.77 R1.2
  Bottom Layer w0.254: 49.76,50.63 49.76,44.43 v1(50.93,43.26) ; UEXT4.3 v1(100.72,47.52)
$1N1663: length 91
  Top Layer w0.254: v1(82.06,55.56) 59.77,55.56 57.38,53.17 ; v1(53.16,49.28) 35.79,49.28 UEXT1.10 ; UEXT4.10 106.63,54.88 103.74,54.88 102.97,55.65 84.54,55.65 82.86,53.97 82.86,53.17
  Bottom Layer w0.254: 82.86,53.17 82.86,54.77 v1(82.06,55.56) ; v1(53.16,49.28) 53.16,48.01 53.56,47.61 56.31,47.61 58.72,50.02 58.72,51.83 57.38,53.17
$1N1691: length 86.9
  Top Layer w0.254: v1(77.78,57.42) 56.56,57.42 52.3,53.17 ; UEXT4.6 101.55,54.88 84.93,54.88 v1(84.82,54.78) ; v1(41.42,54.68) 41.14,54.97 28.62,54.97 UEXT1.6
  Bottom Layer w0.254: v1(84.82,54.78) 83.17,56.43 81.04,56.43 UEXT3.6 v1(77.78,57.42) ; v1(41.42,54.68) 41.64,54.9 50.57,54.9 52.3,53.17
$1N1700: length 91.2
  Top Layer w0.254: v1(100.72,58.38) v1(75.24,58.38) 54.98,58.38 49.76,53.17 47.19,55.73 26.85,55.73 UEXT1.4
  Bottom Layer w0.254: UEXT3.4 v1(75.24,58.38) ; UEXT4.4 v1(100.72,58.38)
$1N1774: length 87.8
  Top Layer w0.254: 83.29,55.63 84.08,56.42 v1(105.8,56.42) ; 83.29,55.63 80.83,53.17 UEXT3.8 ; 83.29,55.63 82.4,56.52 58.19,56.52 54.84,53.17
  Bottom Layer w0.254: UEXT1.8 31.86,55.66 52.35,55.66 54.84,53.17 ; UEXT4.8 v1(105.8,56.42)

## Text on the board
Bottom Silkscreen Layer: R18 | 3V3 Sens Gnd | 1 | UEXT1 | UEXT2 | UEXT3 | UEXT4 | Chaoticvolt | UEXT BUS V1.0
Top Silkscreen Layer: 3V3 Sens Gnd | 1 | Chaoticvolt | UEXT BUS V1.0

# Board PCB_Choaticvolt_DP2_V1
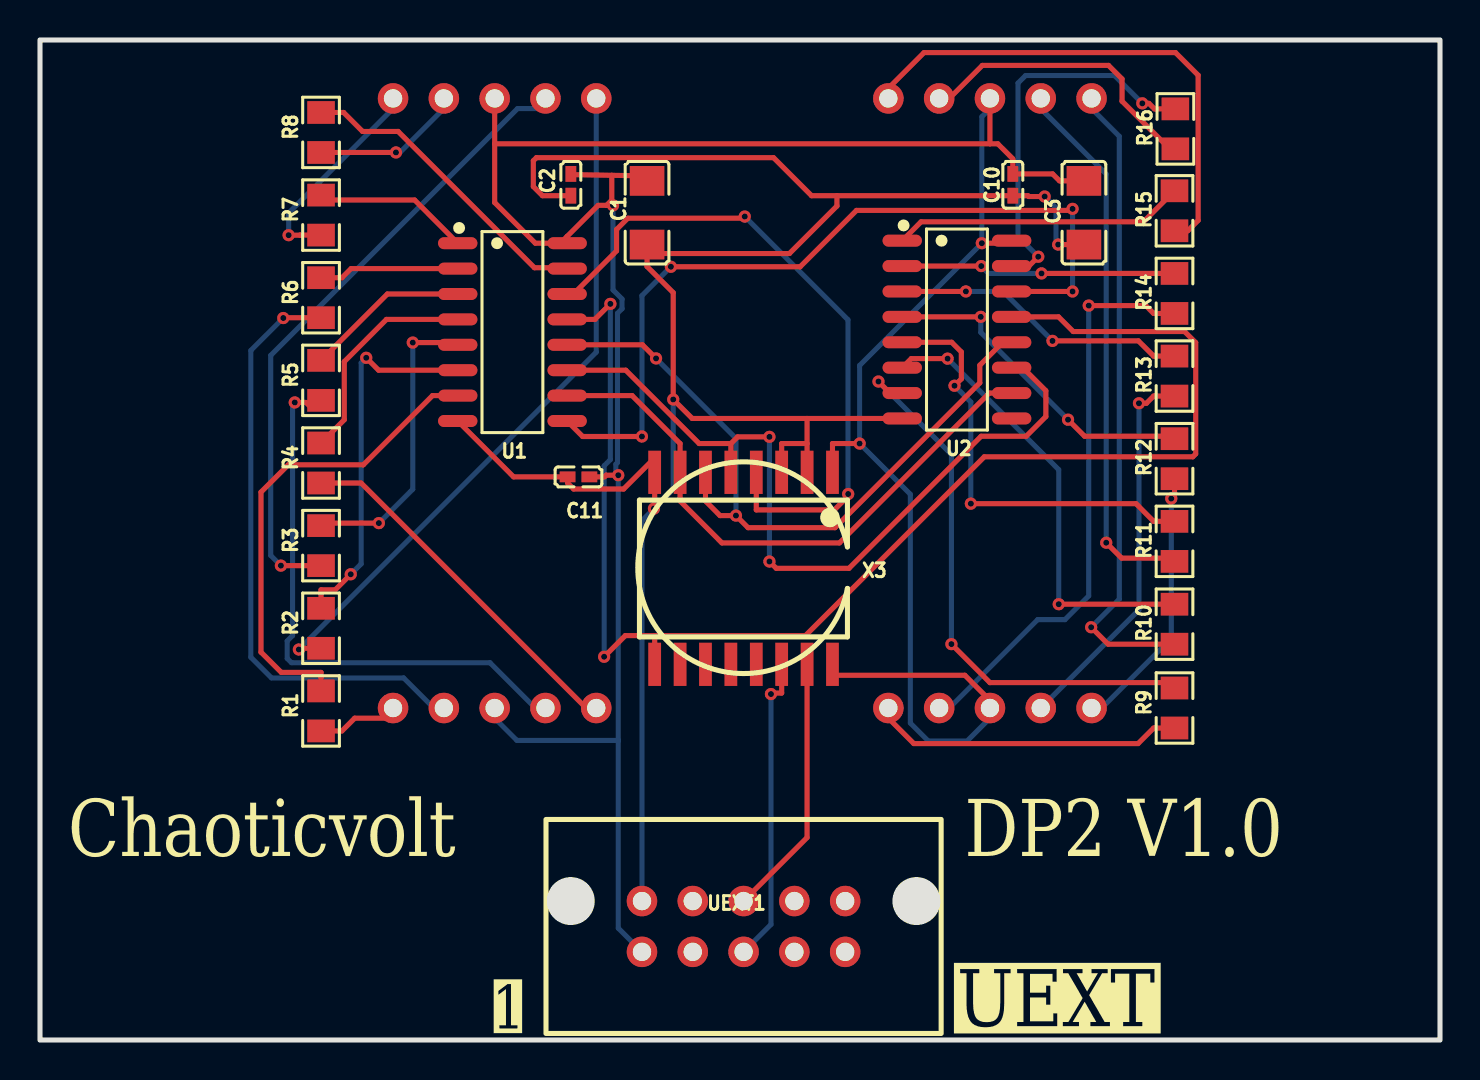
[diagram p4: board, top side]
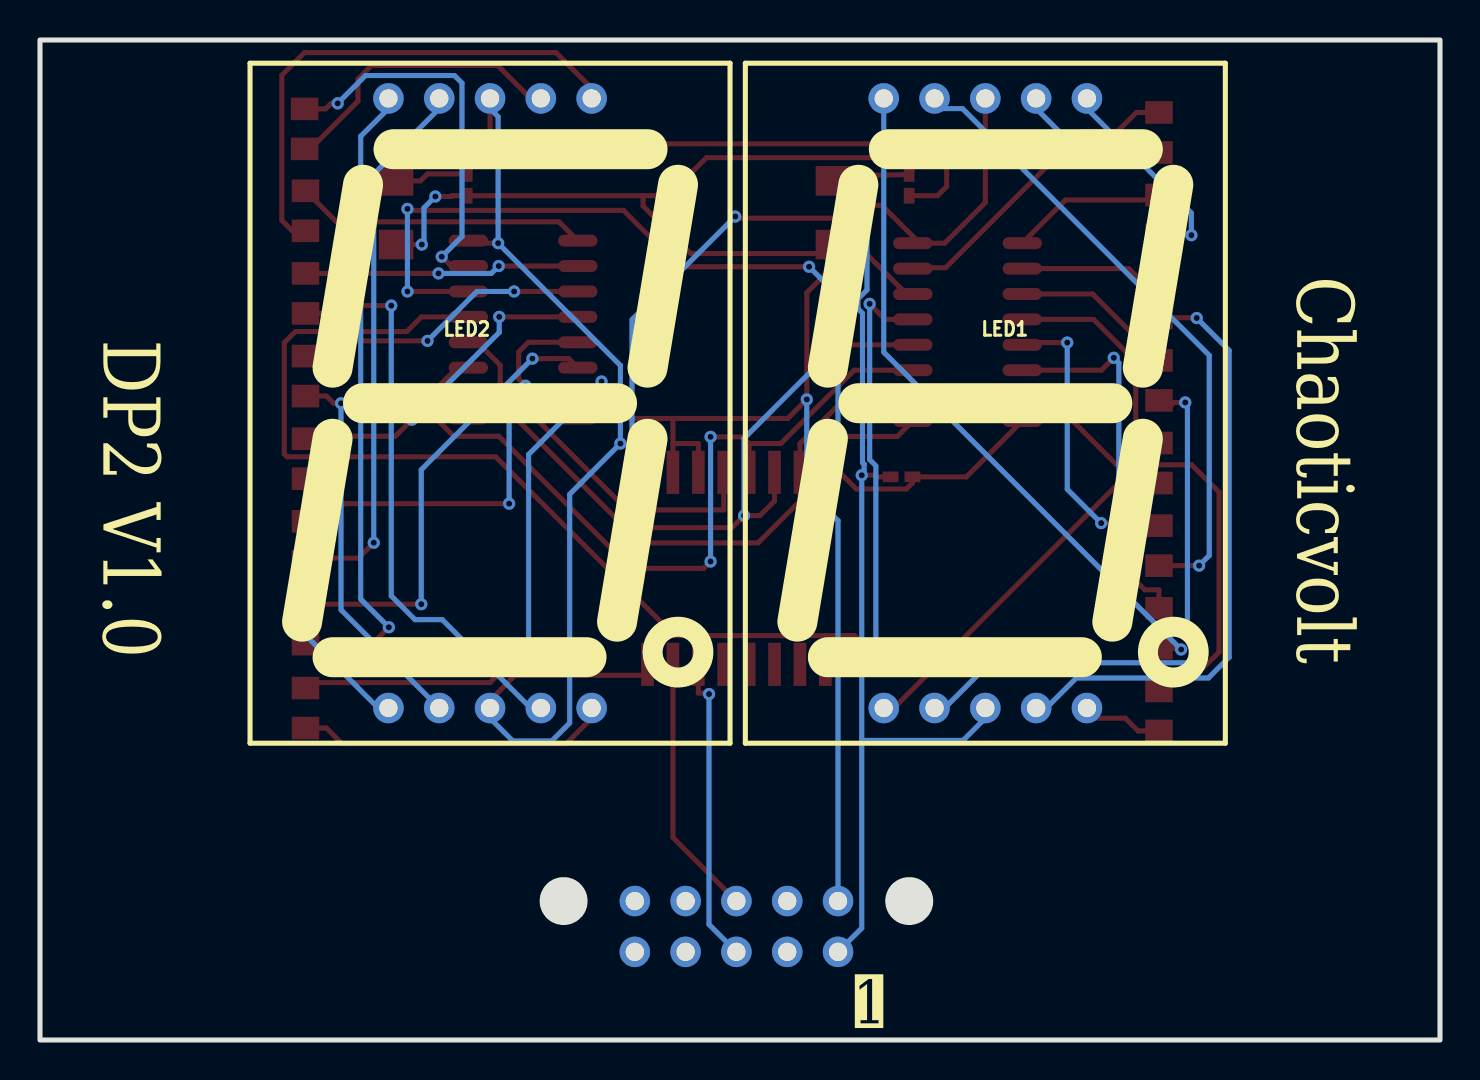
[diagram p5: board, bottom side, seen from below]

Outline 70 x 50 mm; copper layers: Top Layer, Bottom Layer. Coordinates in mm from the lower left corner of the outline.
Outline path: rectangle 0,50 70,0
Stack: Top Layer 0.035mm / Dielectric1 1.51mm FR4 er 4.5 / Bottom Layer 0.035mm

## Design rules (mm)
template: Custom Config
spacing copperThickness1oz (default): track to track 0.102, other pairs 0.152 to 0.3
spacing copperThickness2oz: track to track 0.203, other pairs 0.152 to 0.3
track width copperThickness1oz (default): min 0.127, default 0.254, max 2.54
track width copperThickness2oz: min 0.203, default 0.254, max 2.54
differential pair differentialPair (default): width min 0.127, default 0.254, max 2.54; gap min 0.152, default 0.152
via viaSize (default): diameter min 0.5, default 0.61, max 10; hole min 0.3, default 0.305, max 6.3
net GND uses CV-CopperRule01

## Placement (name value [footprint] x y rotation side)
C1  47uF  [C1206]  30.35 41.36 270 top
C2  100nF  [C0402]  26.54 42.76 270 top
C3  47uF  [C1206]  52.2 41.36 270 top
C10  100nF  [C0402]  48.64 42.76 270 top
C11  100nF  [C0402]  26.92 28.16 0 top
LED1  SM411006N/15  [LED-SEG-TH_10P-L24.0-W34.0-P2.54-S30.48-BL]  22.73 31.84 180 bottom
LED2  SM411006N/15  [LED-SEG-TH_10P-L24.0-W34.0-P2.54-S30.48-BL]  47.5 31.84 180 bottom
R1  120Ω  [R0805]  14.05 16.45 90 top
R2  120Ω  [R0805]  14.05 20.59 90 top
R3  120Ω  [R0805]  14.05 24.72 90 top
R4  120Ω  [R0805]  14.05 28.85 90 top
R5  120Ω  [R0805]  14.05 32.98 90 top
R6  120Ω  [R0805]  14.05 37.11 90 top
R7  120Ω  [R0805]  14.05 41.25 90 top
R8  120Ω  [R0805]  14.05 45.38 90 top
R9  120Ω  [R0805]  56.73 16.6 90 top
R10  120Ω  [R0805]  56.73 20.79 90 top
R11  120Ω  [R0805]  56.73 24.93 90 top
R12  120Ω  [R0805]  56.73 29.06 90 top
R13  120Ω  [R0805]  56.73 33.2 90 top
R14  120Ω  [R0805]  56.73 37.33 90 top
R15  120Ω  [R0805]  56.73 41.46 90 top
R16  120Ω  [R0805]  56.77 45.56 90 top
U1  74HC595D,118  [SOIC-16_L9.9-W3.9-P1.27-LS6.0-BL]  23.62 35.39 270 top
U2  74HC595D,118  [SOIC-16_L9.9-W3.9-P1.27-LS6.0-BL]  45.85 35.52 270 top
UEXT1  15477610  [IDC-TH_15477610]  35.18 5.68 0 top
X3  PCF8574T/TR  [SO-16_L10.3-W7.5-P1.27-LS10.3-BL]  35.18 23.58 180 top

## Footprints (pads in the part's own frame, mm; a bottom-side part is the same pattern mirrored in y, then rotated)
C0402
  rect 0.79x0.54 smd: 1(-0.545,0) 2(0.545,0)
C1206
  rect 1.485x1.728 smd: 1(-1.593,0) 2(1.593,0)
IDC-TH_15477610
  round 1.524 hole 0.914: 1(-5.08,-1.27) 2(-5.08,1.27) 3(-2.54,-1.27) 4(-2.54,1.27) 5(0,-1.27) 6(0,1.27) 7(2.54,-1.27) 8(2.54,1.27) 9(5.08,-1.27) 10(5.08,1.27)
LED-SEG-TH_10P-L24.0-W34.0-P2.54-S30.48-BL
  round 1.524 hole 0.914: 1(-5.08,-15.24) 2(-2.54,-15.24) 3(0,-15.24) 4(2.54,-15.24) 5(5.08,-15.24) 6(5.08,15.24) 7(2.54,15.24) 8(0,15.24) 9(-2.54,15.24) 10(-5.08,15.24)
R0805
  rect 1.133x1.377 smd: 1(-1,0) 2(1,0)
SO-16_L10.3-W7.5-P1.27-LS10.3-BL
  rect 0.635x2.16 smd: 1(-4.445,-4.8) 2(-3.175,-4.8) 3(-1.905,-4.8) 4(-0.635,-4.8) 5(0.635,-4.8) 6(1.905,-4.8) 7(3.175,-4.8) 8(4.445,-4.8) 9(4.445,4.8) 10(3.175,4.8) 11(1.905,4.8) 12(0.635,4.8) 13(-0.635,4.8) 14(-1.905,4.8) 15(-3.175,4.8) 16(-4.445,4.8)
SOIC-16_L9.9-W3.9-P1.27-LS6.0-BL
  oval 0.602x1.971 smd: 1(-4.445,-2.736) 2(-3.175,-2.736) 3(-1.905,-2.736) 4(-0.635,-2.736) 5(0.635,-2.736) 6(1.905,-2.736) 7(3.175,-2.736) 8(4.445,-2.736) 9(4.445,2.736) 10(3.175,2.736) 11(1.905,2.736) 12(0.635,2.736) 13(-0.635,2.736) 14(-1.905,2.736) 15(-3.175,2.736) 16(-4.445,2.736)

## Nets
As in the schematic.

Pads without a net: U2 9; UEXT1 3 4 7 8 9 10; X3 10 11 12 13

## Via types
v1: diameter 0.61, hole 0.305, Top Layer to Bottom Layer, 50 vias

## Routing (per net, layer and track width the routed paths; a pad name or vN(x,y) marks a point on that pad's centre or on a via; arc(x,y) is an arc through that point)
GND: length 110.7
  Top Layer w0.254: X3.2 38.35,29.82 ; 38.35,29.82 38.35,31.08 ; 38.35,29.82 37.08,29.82 X3.3 ; 38.35,31.08 U2.8 ; 38.35,31.08 32.61,31.08 v1(31.66,32.03) 31.66,37.37 30.35,38.67 30.35,39.22 ; v1(50.91,39.77) C3.2 ; 39.85,42.22 39.85,41.7 37.47,39.32 30.46,39.32 30.35,39.22 ; 39.85,42.22 38.58,42.22 36.68,44.12 24.82,44.12 24.67,43.96 24.67,42.67 25.12,42.22 26.54,42.22 ; 39.85,42.22 49.4,42.22 49.44,42.17 v1(50.23,42.17) ; v1(30.7,26.57) 30.73,26.61 X3.8 30.73,29.1 29.18,27.55 26.68,27.55 26.38,27.85 26.38,28.16 23.68,28.16 U1.8 ; 30.35,39.22 C1.2
  Bottom Layer w0.254: v1(50.23,42.17) 50.8,41.61 50.8,39.88 v1(50.91,39.77) ; v1(31.66,32.03) 31.66,27.53 v1(30.7,26.57) 30.1,25.97 UEXT1.2
VCC: length 150.3
  Top Layer w0.254: v1(47.09,39.84) 48.46,39.84 U2.16 ; C2.1 26.58,43.27 28.59,43.23 ; 47.5,46.57 47.5,44.81 ; 47.5,44.81 47.89,44.81 48.64,44.06 C10.1 50.63,43.3 50.98,42.96 C3.1 ; 47.5,44.81 22.73,44.81 ; 22.73,44.81 22.73,46.57 ; 22.73,44.81 22.73,41.87 24.76,39.84 26.02,39.84 26.36,40.18 ; 26.36,40.18 U1.16 ; 26.36,40.18 27.91,41.73 28.33,41.73 ; 28.59,43.23 28.59,42 28.33,41.73 ; 28.59,43.23 29.97,43.21 30.23,42.96 C1.1 ; v1(40.98,29.82) 39.62,29.82 X3.1 ; X3.16 39.62,18.24 46.24,18.24 47.5,16.98 47.5,16.09 ; 27.47,28.16 28.22,28.16 28.31,28.24 v1(28.91,28.24) ; 28.33,41.73 v1(28.65,41.73)
  Bottom Layer w0.254: UEXT1.1 28.91,5.59 28.91,14.98 ; v1(28.65,41.73) 28.65,37.5 29.1,37.05 29.1,36.57 28.88,36.34 28.88,28.87 28.79,28.79 28.79,28.36 v1(28.91,28.24) 28.91,14.98 ; 28.91,14.98 23.84,14.98 22.73,16.09 ; 47.5,46.57 47.09,46.16 v1(47.09,39.84) 40.98,33.73 v1(40.98,29.82) 43.52,27.28 43.52,15.85 44.41,14.95 46.35,14.95 47.5,16.09
$1N2392: length 24.2
  Top Layer w0.254: U1.7 19.63,32.22 16.17,28.76 12.42,28.76 11.05,27.39 11.05,19.39 12.06,18.38 14.05,18.38 14.05,17.45
$1N2394: length 11.1
  Top Layer w0.254: U1.4 17.32,36.03 15.21,33.92 15.21,31.01 R4.2
$1N2395: length 7
  Top Layer w0.254: U1.2 15.56,38.57 15.1,38.11 14.05,38.11
$1N2396: length 8
  Top Layer w0.254: U1.1 18.73,42 14.05,42 R7.2
$1N2397: length 18.7
  Top Layer w0.254: U1.6 16.93,33.49 v1(16.31,34.11) ; 14.05,21.58 14.05,22.51 14.76,22.51 v1(15.54,23.29)
  Bottom Layer w0.254: v1(15.54,23.29) 16.06,23.81 16.06,33.86 v1(16.31,34.11)
$1N2398: length 8.4
  Top Layer w0.254: U1.3 17.37,37.3 14.32,34.25 14.05,34.25 R5.2
$1N2399: length 15
  Top Layer w0.254: R3.2 14.18,25.84 v1(16.94,25.84) ; v1(18.64,34.87) 20.78,34.87 U1.5
  Bottom Layer w0.254: v1(18.64,34.87) 18.64,27.54 v1(16.94,25.84)
$1N2400: length 15.5
  Top Layer w0.254: 14.05,46.38 15.18,46.38 16.13,45.43 17.91,45.43 24.72,38.61 26.31,38.61 U1.15
$1N2411: length 28.3
  Top Layer w0.254: v1(45.57,19.79) 47.5,17.87 56.73,17.87 R9.2 ; U2.7 42.5,32.35 v1(41.92,32.92)
  Bottom Layer w0.254: v1(45.57,19.79) 45.57,29.28 v1(41.92,32.92)
$1N2412: length 16.7
  Top Layer w0.254: v1(51.4,31.02) 52.23,30.19 56.7,30.19 56.73,30.16 R12.2 ; 43.11,36.16 v1(47.04,36.16)
  Bottom Layer w0.254: v1(47.04,36.16) 47.04,35.38 v1(51.4,31.02)
$1N2413: length 13.8
  Top Layer w0.254: U2.2 v1(47.06,38.7) ; R14.2 v1(50.08,38.33)
  Bottom Layer w0.254: v1(47.06,38.7) 47.43,38.33 v1(50.08,38.33)
$1N2414: length 14.6
  Top Layer w0.254: U2.1 44.05,40.91 55.17,40.91 R15.2
$1N2415: length 22.8
  Top Layer w0.254: U2.6 43.56,34.07 v1(45.38,34.07) ; v1(50.94,21.79) R10.2
  Bottom Layer w0.254: v1(50.94,21.79) 50.94,28.51 v1(45.38,34.07)
$1N2416: length 15
  Top Layer w0.254: R13.2 55.68,34.2 54.92,34.96 v1(50.62,34.96) ; U2.3 v1(46.29,37.43)
  Bottom Layer w0.254: v1(46.29,37.43) 48.15,37.43 v1(50.62,34.96)
$1N2417: length 21.8
  Top Layer w0.254: 56.73,25.93 55.68,25.93 54.8,26.82 v1(46.54,26.82) ; U2.5 45.58,34.89 46.07,34.4 46.07,33.06 v1(45.72,32.71)
  Bottom Layer w0.254: v1(45.72,32.71) 46.54,31.89 v1(46.54,26.82)
$1N2418: length 19.3
  Top Layer w0.254: v1(55.12,46.83) 55.45,46.83 55.72,46.56 R16.2 ; v1(49.91,39.16) 49.45,38.7 U2.15
  Bottom Layer w0.254: v1(49.91,39.16) 48.9,40.18 48.9,47.85 49.28,48.22 53.73,48.22 v1(55.12,46.83)
$1N2428: length 41.6
  Top Layer w0.254: U1.9 27.13,30.17 v1(30.1,30.17) ; U2.14 v1(51.63,37.43) ; v1(51.63,41.56) 51.55,41.48 40.83,41.48 38.01,38.66 v1(31.54,38.66)
  Bottom Layer w0.254: v1(30.1,30.17) 30.1,37.21 v1(31.54,38.66) ; v1(51.63,41.56) v1(51.63,37.43)
$1N2430: length 40
  Top Layer w0.254: X3.5 34.54,29.82 ; 34.54,29.82 32.96,29.82 29.29,33.49 U1.11 ; 34.54,29.82 34.88,30.16 v1(36.47,30.16) ; v1(36.47,23.92) 36.81,23.58 40.45,23.58 47.06,30.19 49.31,30.19 50.29,31.17 50.29,32.46 49.14,33.62 U2.11
  Bottom Layer w0.254: v1(36.47,23.92) v1(36.47,30.16)
$1N2434: length 35.9
  Top Layer w0.254: v1(30.8,34.08) 30.12,34.76 U1.12 ; U2.12 48.14,34.89 46.99,33.74 46.99,32.86 39.75,25.62 35.4,25.62 v1(34.8,26.22) 34,26.22 33.27,26.95 X3.6
  Bottom Layer w0.254: v1(34.8,26.22) 34.8,30.08 v1(30.8,34.08)
$1N2437: length 70.8
  Top Layer w0.254: v1(28.21,19.16) 29.27,20.22 30.73,20.22 ; X3.9 30.73,20.22 ; 30.73,20.22 38.27,20.22 47.21,29.16 57.64,29.16 57.78,29.3 57.78,34.87 57.23,35.42 51.66,35.42 50.93,36.16 48.58,36.16 ; v1(28.52,36.81) 27.74,36.03 U1.13
  Bottom Layer w0.254: v1(28.52,36.81) 28.52,29.02 28.21,28.71 v1(28.21,19.16)
$1N3740: length 34
  Top Layer w0.254: U1.14 26.68,37.3 28.83,39.46 28.83,40.53 29.39,41.09 35.15,41.09 v1(35.24,41.17) ; X3.4 35.81,26.5 39.72,26.5 40.41,27.2 v1(40.41,27.3)
  Bottom Layer w0.254: v1(35.24,41.17) 40.4,36.01 40.4,27.31 v1(40.41,27.3)
$1N3774: length 30.1
  Top Layer w0.254: U2.10 47.47,32.35 39.97,24.85 34.1,24.85 32,26.95 X3.7 32,29.82 29.61,32.22 U1.10
$1N3917: length 15.5
  Top Layer w0.254: v1(36.55,17.3) 36.6,17.35 37.08,17.35 X3.14
  Bottom Layer w0.254: UEXT1.5 36.55,5.78 v1(36.55,17.3)
$1N3924: length 13.2
  Top Layer w0.254: X3.15 38.35,10.12 UEXT1.6
$1N26641: length 10.1
  Top Layer w0.254: v1(12.43,40.24) 13,40.24 13.01,40.25 R7.1
  Bottom Layer w0.254: 17.65,46.57 12.43,41.35 v1(12.43,40.24)
$1N26647: length 7.1
  Top Layer w0.254: R8.1 v1(17.8,44.38)
  Bottom Layer w0.254: 20.19,46.57 18,44.38 v1(17.8,44.38)
$1N26729: length 29
  Top Layer w0.254: v1(12.74,31.88) 13.3,31.88 13.56,31.62 14.16,31.62 14.16,31.87 14.05,31.98
  Bottom Layer w0.254: 25.27,16.09 22.5,18.86 12.57,18.86 12.36,19.08 12.36,19.95 12.63,20.22 12.63,31.77 v1(12.74,31.88)
$1N26736: length 18.6
  Top Layer w0.254: 27.81,16.09 16.06,27.85 14.05,27.85
$1N26743: length 31.6
  Top Layer w0.254: v1(12.04,23.72) R3.1
  Bottom Layer w0.254: v1(12.04,23.72) 11.54,24.23 11.54,34.23 23.88,46.57 25.27,46.57
$1N26751: length 34.3
  Top Layer w0.254: v1(12.94,19.53) 13.01,19.59 R2.1
  Bottom Layer w0.254: v1(12.94,19.53) 27.81,34.39 27.81,46.57
$1N26868: length 26.4
  Top Layer w0.254: 42.42,46.57 42.42,47.59 44.2,49.37 56.77,49.37 57.91,48.24 57.91,40.98 57.39,40.46 R15.1
$1N26872: length 15.1
  Top Layer w0.254: 56.77,44.55 56.49,44.55 54.1,46.94 54.1,48.05 53.43,48.73 47.12,48.73 44.96,46.57
$1N26877: length 19.7
  Top Layer w0.254: R13.1 55.68,32.2 55.32,31.84 v1(54.95,31.84)
  Bottom Layer w0.254: 50.04,16.09 LED2.2 54.95,21.51 v1(54.95,31.84)
$1N26881: length 13.7
  Top Layer w0.254: v1(56.56,27.07) 56.63,27.14 56.73,27.14 R12.1
  Bottom Layer w0.254: v1(56.56,27.07) 56.56,20.08 52.58,16.09
$1N26885: length 27
  Top Layer w0.254: v1(53.31,24.86) 54.08,24.09 56.73,24.09 R11.1
  Bottom Layer w0.254: 50.04,46.57 53.31,43.3 v1(53.31,24.86)
$1N26891: length 31.6
  Top Layer w0.254: 56.73,19.79 53.41,19.79 v1(52.56,20.64)
  Bottom Layer w0.254: v1(52.56,20.64) 53.97,22.04 53.97,45.18 52.58,46.57
$1N27647: length 30.4
  Top Layer w0.254: R6.1 12.18,36.11 v1(12.16,36.1)
  Bottom Layer w0.254: 20.19,16.09 18.18,18.1 11.58,18.1 10.54,19.14 10.54,34.48 v1(12.16,36.1)
$1N27662: length 3.9
  Top Layer w0.254: R1.1 15.1,15.45 15.74,16.09 17.65,16.09
$1N27688: length 29
  Top Layer w0.254: R14.1 55.68,36.33 55.29,36.72 v1(52.44,36.72)
  Bottom Layer w0.254: v1(52.44,36.72) 52.44,22.2 51.25,21.02 49.89,21.02 44.96,16.09
$1N27703: length 15.2
  Top Layer w0.254: 42.42,16.09 43.69,14.82 54.9,14.82 55.68,15.6 56.73,15.6

## Text on the board
Bottom Silkscreen Layer: 1 | DP2 V1.0 | Chaoticvolt
Top Silkscreen Layer: 1 | Chaoticvolt | UEXT | DP2 V1.0
